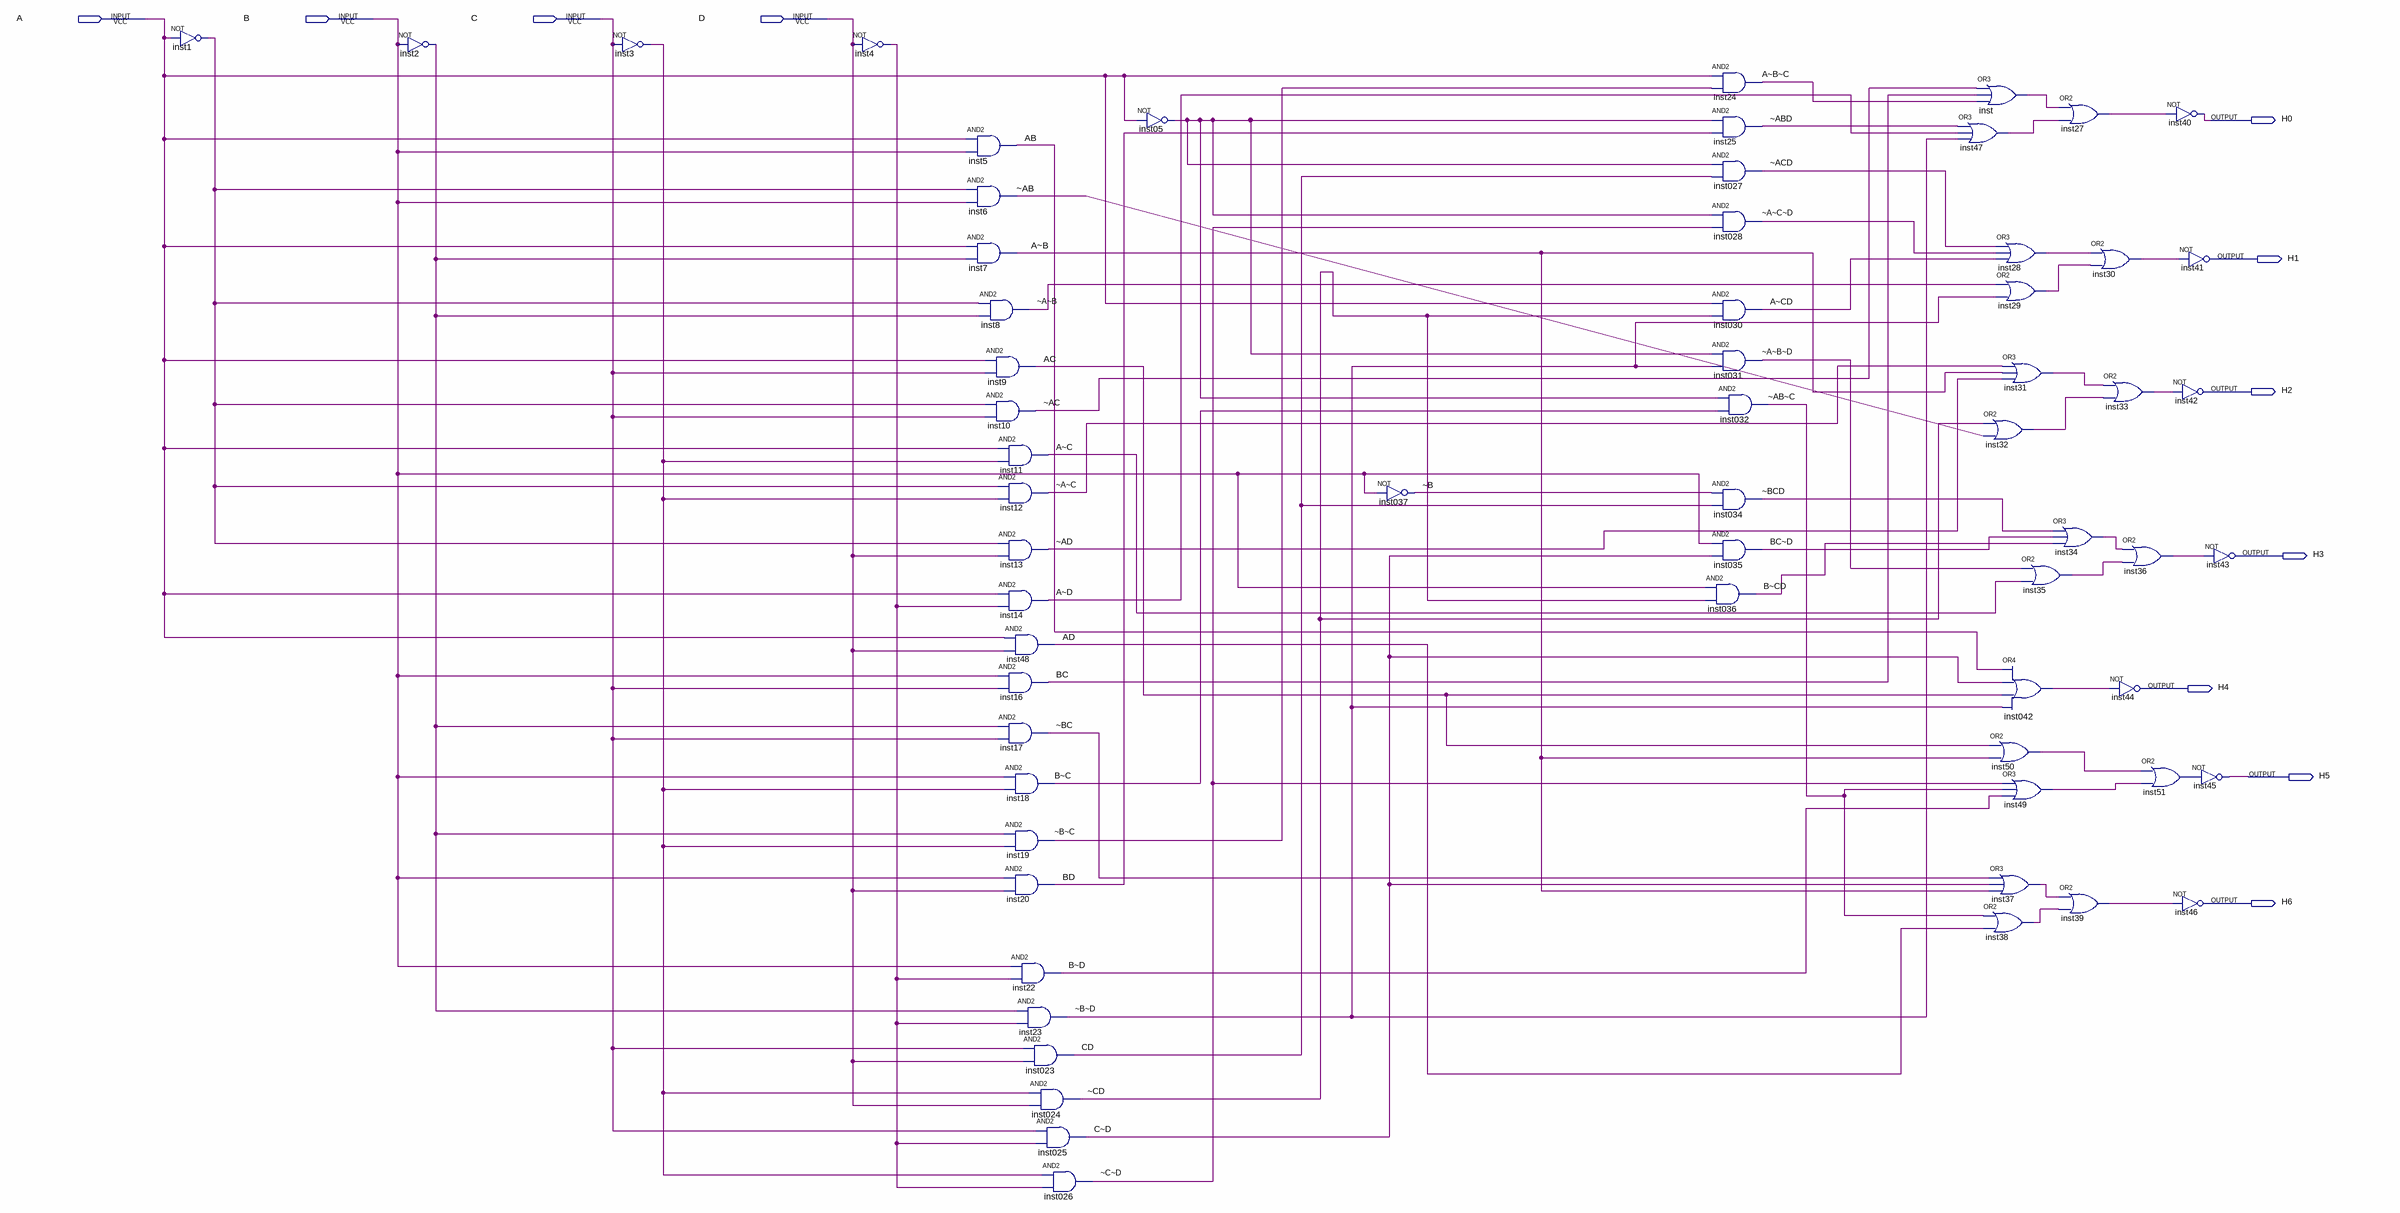
[diagram p0: schematic sheet]
// Quartus schematic displaysegmentos.bdf as structural Verilog: 64 symbols, 11 pins
module displaysegmentos (
  input  A,
  input  B,
  input  C,
  input  D,
  output H0,
  output H1,
  output H2,
  output H3,
  output H4,
  output H5,
  output H6
);

  wire AB, AC, AD, \A~B , \A~B~C , \A~C , \A~CD , \A~D , BC, \BC~D , BD, \B~C , \B~CD , \B~D , CD, \C~D ,
       inst1_out, inst2_out, inst3_out, inst4_out, inst05_out, inst27_out, inst28_out, inst29_out,
       inst30_out, inst31_out, inst32_out, inst33_out, inst34_out, inst35_out, inst36_out, inst37_out,
       inst38_out, inst39_out, inst042_out, inst47_out, inst49_out, inst50_out, inst51_out, inst_out, \~AB ,
       \~ABD , \~AB~C , \~AC , \~ACD , \~AD , \~A~B , \~A~B~D , \~A~C , \~A~C~D , \~B , \~BC , \~BCD ,
       \~B~C , \~B~D , \~CD , \~C~D ;

  not inst1 (inst1_out, A);
  not inst2 (inst2_out, B);
  not inst3 (inst3_out, C);
  not inst4 (inst4_out, D);
  and inst5 (AB, A, B);
  and inst6 (\~AB , inst1_out, B);
  and inst7 (\A~B , A, inst2_out);
  and inst8 (\~A~B , inst1_out, inst2_out);
  and inst9 (AC, A, C);
  and inst10 (\~AC , inst1_out, C);
  and inst11 (\A~C , A, inst3_out);
  and inst12 (\~A~C , inst1_out, inst3_out);
  and inst13 (\~AD , inst1_out, D);
  and inst14 (\A~D , A, inst4_out);
  and inst48 (AD, A, D);
  and inst16 (BC, B, C);
  and inst17 (\~BC , inst2_out, C);
  and inst18 (\B~C , B, inst3_out);
  and inst19 (\~B~C , inst2_out, inst3_out);
  and inst20 (BD, B, D);
  and inst22 (\B~D , B, inst4_out);
  and inst23 (\~B~D , inst2_out, inst4_out);
  and inst023 (CD, C, D);
  and inst024 (\~CD , inst3_out, D);
  and inst025 (\C~D , C, inst4_out);
  and inst026 (\~C~D , inst3_out, inst4_out);
  not inst05 (inst05_out, A);
  not inst037 (\~B , B);
  and inst24 (\A~B~C , A, \~B~C );
  and inst25 (\~ABD , inst05_out, BD);
  and inst027 (\~ACD , inst05_out, CD);
  and inst028 (\~A~C~D , inst05_out, \~C~D );
  and inst030 (\A~CD , A, \~CD );
  and inst031 (\~A~B~D , inst05_out, \~B~D );
  and inst032 (\~AB~C , inst05_out, \B~C );
  and inst034 (\~BCD , \~B , CD);
  and inst035 (\BC~D , B, \C~D );
  and inst036 (\B~CD , B, \~CD );
  or inst (inst_out, \~AC , BC, \A~B~C );
  or inst47 (inst47_out, \~ABD , \A~D , \~B~D );
  or inst32 (inst32_out, \~CD , \~AB );
  or inst50 (inst50_out, AC, \A~B );
  or inst37 (inst37_out, \~BC , \C~D , \A~B );
  or inst38 (inst38_out, \~AB~C , AD);
  or inst28 (inst28_out, \~ACD , \~A~C~D , \A~CD );
  or inst29 (inst29_out, \~A~B , \~B~D );
  or inst31 (inst31_out, \~A~C , \A~B , \~AD );
  or inst35 (inst35_out, \~A~B~D , \A~C );
  or inst042 (inst042_out, AB, \C~D , AC, \~B~D );
  or inst49 (inst49_out, \~C~D , \~AB~C , \B~D );
  or inst27 (inst27_out, inst_out, inst47_out);
  or inst30 (inst30_out, inst28_out, inst29_out);
  or inst34 (inst34_out, \~BCD , \BC~D , \B~CD );
  or inst39 (inst39_out, inst37_out, inst38_out);
  or inst33 (inst33_out, inst31_out, inst32_out);
  or inst36 (inst36_out, inst34_out, inst35_out);
  not inst44 (H4, inst042_out);
  or inst51 (inst51_out, inst50_out, inst49_out);
  not inst40 (H0, inst27_out);
  not inst41 (H1, inst30_out);
  not inst42 (H2, inst33_out);
  not inst45 (H5, inst51_out);
  not inst46 (H6, inst39_out);
  not inst43 (H3, inst36_out);
endmodule
